# EAGLE design LSM9DS1-Breakout (EAGLE 9.3.2)
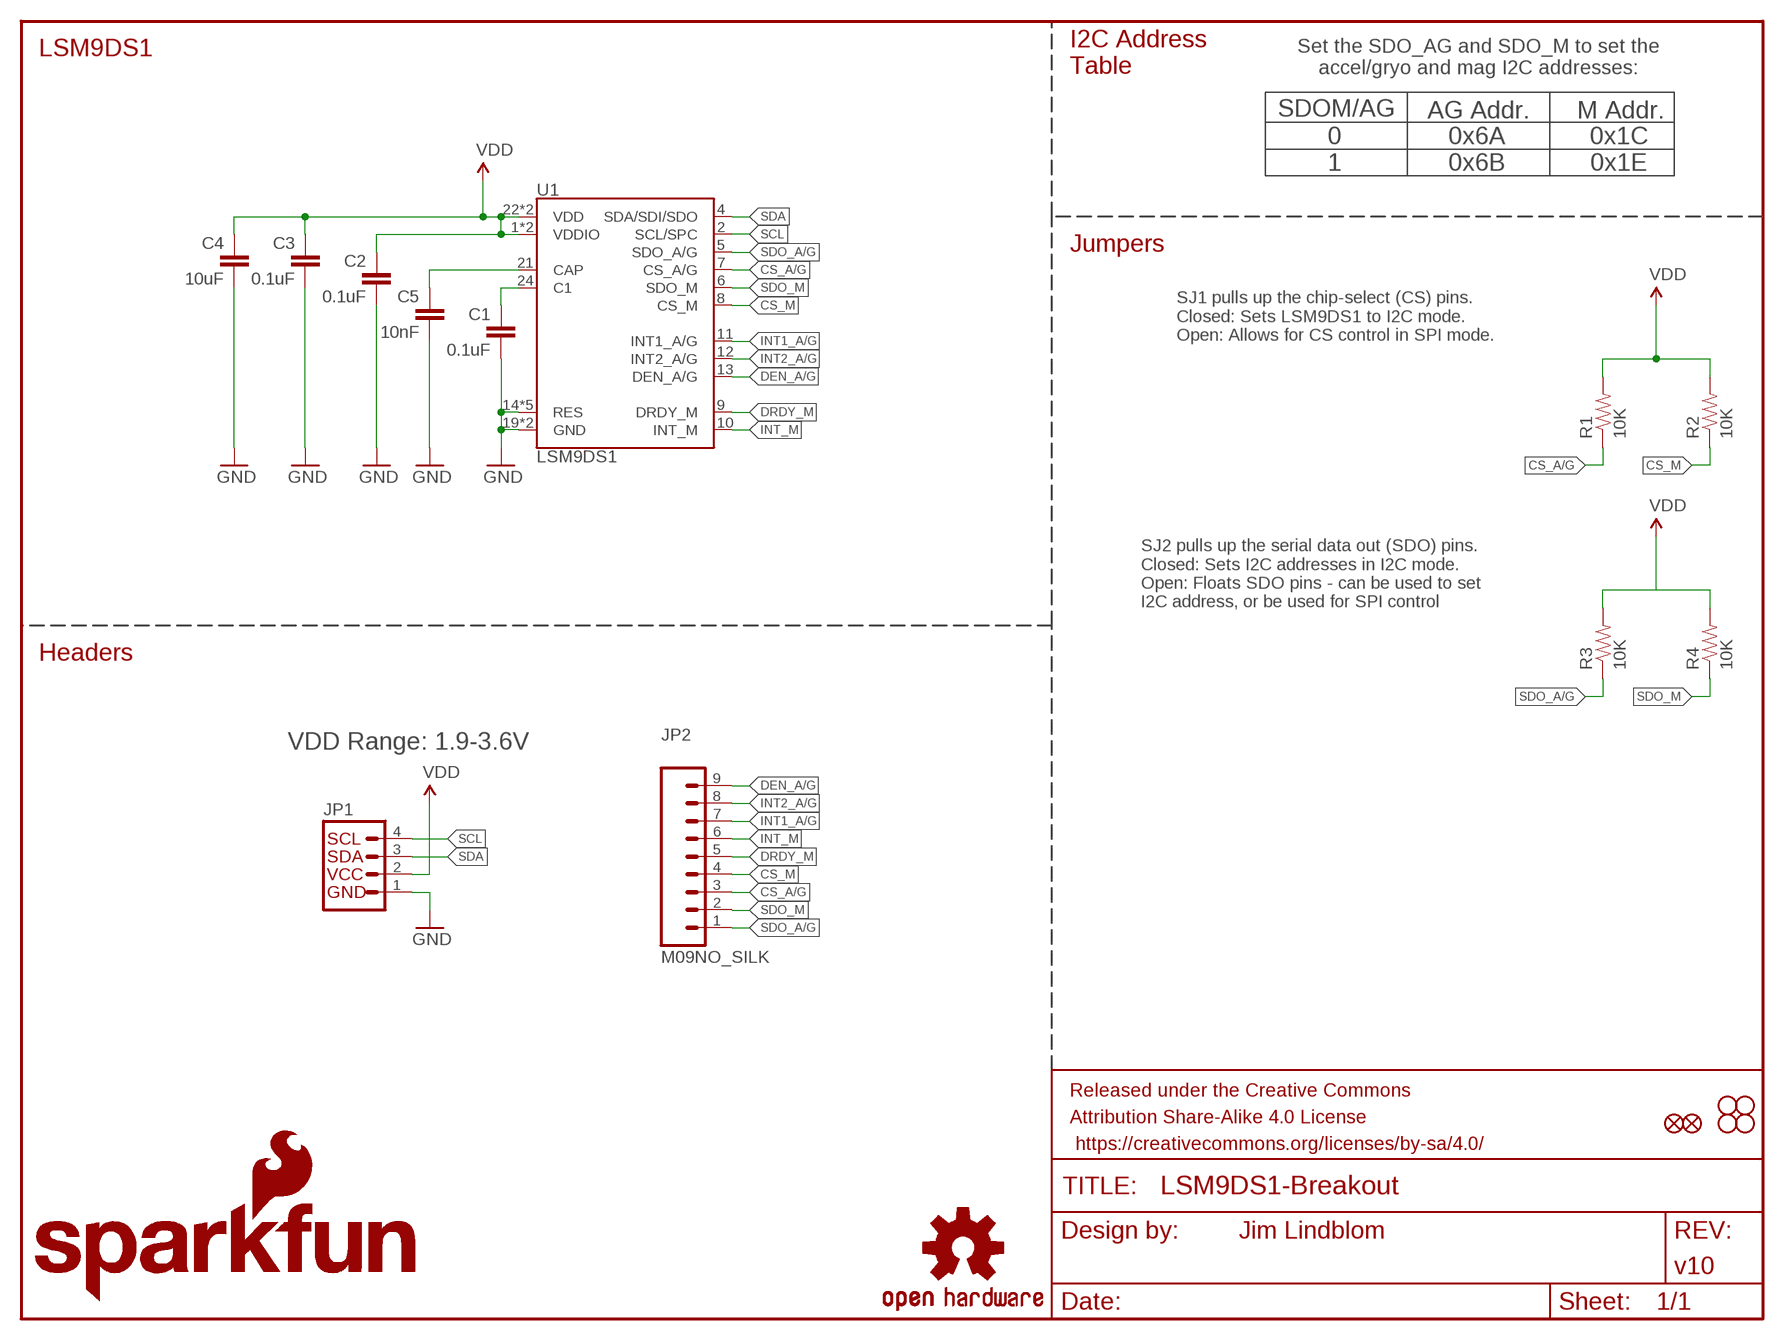
[diagram p0: schematic, sheet 1]

## Parts
C1  0.1uF  0.1UF-25V(+80/-20%)(0603)  [0603-CAP]
C2  0.1uF  0.1UF-25V(+80/-20%)(0603)  [0603-CAP]
C3  0.1uF  0.1UF-25V(+80/-20%)(0603)  [0603-CAP]
C4  10uF  10UF-6.3V-20%(0603)  [0603-CAP]
C5  10nF  10NF/10000PF-50V-10%(0603)  [0603-CAP]
FID1  FIDUCIAL1X2  [FIDUCIAL-1X2]
FID2  FIDUCIAL1X2  [FIDUCIAL-1X2]
FRAME1  FRAME-LETTER  [CREATIVE_COMMONS]
JP1  I2C_STANDARD_NO_SILK  [1X04_NO_SILK]
JP2  M09NO_SILK  [1X09_NO_SILK]
LOGO1  SFE_LOGO_NAME.1_INCH  [SFE_LOGO_NAME_.1]
LOGO2  SFE_LOGO_FLAME.2_INCH  [SFE_LOGO_FLAME_.2]
LOGO3  OSHW-LOGOS  [OSHW-LOGO-S]
R1  10K  10KOHM-1/10W-1%(0603)0603  [0603-RES]
R2  10K  10KOHM-1/10W-1%(0603)0603  [0603-RES]
R3  10K  10KOHM-1/10W-1%(0603)0603  [0603-RES]
R4  10K  10KOHM-1/10W-1%(0603)0603  [0603-RES]
STANDOFF1  STAND-OFF  [STAND-OFF]
STANDOFF2  STAND-OFF  [STAND-OFF]
STANDOFF3  STAND-OFF  [STAND-OFF]
STANDOFF4  STAND-OFF  [STAND-OFF]
U1  LSM9DS1  [LGA24-8X4]

## Nets
C1: C1.1 U1.24(C1)
CAP: C5.1 U1.21(CAP)
CS_A/G: JP2.3 R1.1 U1.7(CS_A/G)
CS_M: JP2.4 R2.1 U1.8(CS_M)
DEN_A/G: JP2.9 U1.13(DEN_A/G)
DRDY_M: JP2.5 U1.9(DRDY_M)
GND: C1.2 C2.2 C3.2 C4.2 C5.2 JP1.1 U1.14(RES) U1.15(RES) U1.16(RES) U1.17(RES) U1.18(RES) U1.19(GND) U1.20(GND)
INT1_A/G: JP2.7 U1.11(INT1_A/G)
INT2_A/G: JP2.8 U1.12(INT2_A/G)
INT_M: JP2.6 U1.10(INT_M)
SCL: JP1.4 U1.2(SCL/SPC)
SDA: JP1.3 U1.4(SDA/SDI/SDO)
SDO_A/G: JP2.1 R3.1 U1.5(SDO_A/G)
SDO_M: JP2.2 R4.1 U1.6(SDO_M)
VDD: C2.1 C3.1 C4.1 JP1.2 R1.2 R2.2 R3.2 R4.2 U1.1(VDDIO) U1.3(VDDIO) U1.22(VDD) U1.23(VDD)

## Notes on the sheet
- LSM9DS1
- Set the SDO_AG and SDO_M to set the
  accel/gryo and mag I2C addresses:
- I2C Address
  Table
- SDOM/AG | AG Addr. | M Addr.
- 0
  1
- 0x6A
  0x6B
- 0x1C
  0x1E
- Jumpers
- SJ1 pulls up the chip-select (CS) pins.
  Closed: Sets LSM9DS1 to I2C mode.
  Open: Allows for CS control in SPI mode.
- SJ2 pulls up the serial data out (SDO) pins.
  Closed: Sets I2C addresses in I2C mode.
  Open: Floats SDO pins - can be used to set
  I2C address, or be used for SPI control
- Headers
- VDD Range: 1.9-3.6V

## Library data of the parts
C1-C3 = SparkFun-Capacitors:0.1UF-25V(+80/-20%)(0603): CAP-00810 Ceramic Standard decoupling cap; PROD_ID: CAP-00810
C4 = SparkFun-Capacitors:10UF-6.3V-20%(0603): CAP-11015; PROD_ID: CAP-11015
C5 = SparkFun-Capacitors:10NF/10000PF-50V-10%(0603): CAP-00867; PROD_ID: CAP-00867
FID1 FID2 = SparkFun-Aesthetics:FIDUCIAL: Fiducial Alignment Points Various fiducial points for machine vision alignment.
FRAME1 = SparkFun-Aesthetics:FRAME-LETTER: Schematic Frame Standard 8.5x11 US Letter frame; DESIGNER: Jim Lindblom; VERSION: v10
JP1 = SparkFun-Connectors:I2C_STANDARD: SparkFun has standardized on a pinout for all I2C based sensor breakouts. This pinout allows I2C boards to be plugged directly into the headers on Arduino Uno compatible boards, and to be daisy chained easily.
JP2 = SparkFun-Connectors:M09: Header 9 Standard 9-pin 0.1" header. Use with straight break away headers (SKU : PRT-00116), right angle break away headers (PRT-00553), swiss pins (PRT-00743), machine pins (PRT-00117), and female headers (PRT-00115).
LOGO1 = SparkFun-Aesthetics:SFE_LOGO_NAME: SFE Logo, name only This is the SparkFun name logo. The logo on the schematic will always be the same size; the package variant is the height of the flame part of the logo (or the height the flame would be, if it were drawn). Default layer for the logo on the board is tSilk.
LOGO2 = SparkFun-Aesthetics:SFE_LOGO_FLAME: SFE Logo, flame only This is the SparkFun flame logo. The logo on the schematic will always be the same size; the package variant is the height of the flame. Default layer for the logo on the board is tSilk.
LOGO3 = SparkFun-Aesthetics:OSHW-LOGO: Open Source Hardware Logo This logo indicates the piece of hardware it is found on incorporates a OSHW license and/or adheres to the definition of open source hardware found here: http://freedomdefined.org/OSHW
R1-R4 = SparkFun-Resistors:10KOHM-1/10W-1%(0603): RES-00824; PROD_ID: RES-00824
STANDOFF1-STANDOFF4 = SparkFun-Electromechanical:STAND-OFF: #4 Stand Off This is the mechanical footprint for a #4 phillips button head screw. Use the keepout ring to avoid running the screw head into surrounding components. SKU : PRT-00447
U1 = LSM9DS1_temp:LSM9DS1: LSM9DS1 3D accelerometer, gyroscope & magnetometer The LSM9DS1 is a system-in-package featuring a 3D digital linear acceleration sensor, a 3D digital angular rate sensor, and a 3D digital magnetic sensor. The LSM9DS1 has a linear acceleration full scale of ±2g/±4g/±8/±16 g, a magnetic field full scale of ±4/±8/±12/±16 gauss and an angular rate of ±245/±500/±2000 dps. The LSM9DS1 includes an I2 C serial bus interface supporting standard and fast mode (100 kHz and 400 kHz) and an SPI serial standard interface. Magnetic, accelerometer and gyroscope sensing can be enabled or set in power-down mode separately for smart power management. The LSM9DS1 is available in a plastic land grid array package (LGA) and it is guaranteed to operate over an extended temperature range from -40 °C to +85 °C.; PROD_ID: IC-12536

## Board
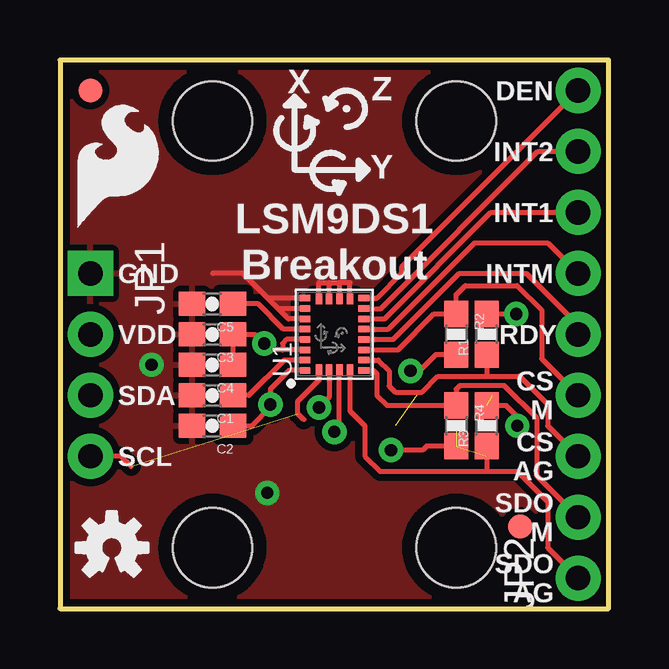
[diagram p1: board, top side]
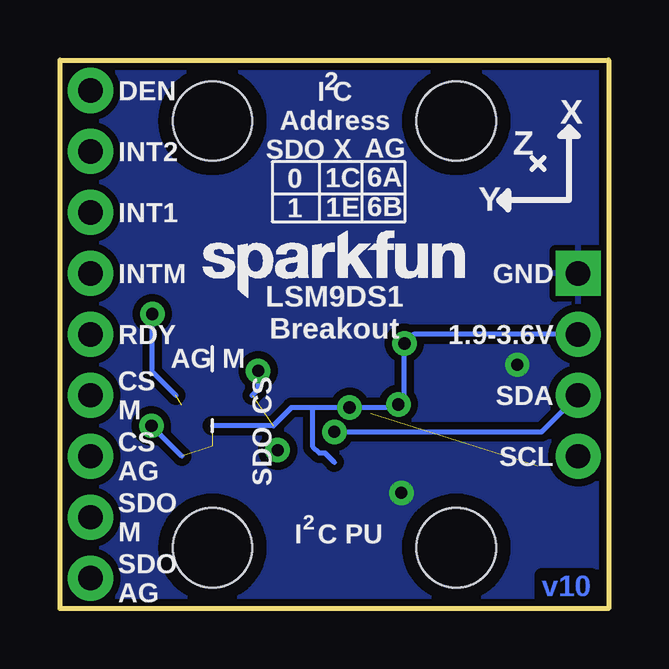
[diagram p2: board, bottom side, seen from below]

Size 22.86 x 22.86 mm. Coordinates in mm from the lower left corner, seen from the top.
Outline: 22.86,22.86 0,22.86 0,0 22.86,0 22.86,22.86
Copper layers (1*16): Top 0.035mm / dielectric 1.5mm / Bottom 0.035mm
Design rules "SparkFun-2-layer *": minimum track width 7mil, minimum drill 15mil, track to track 6mil, track to pad 6mil, pad to pad 6mil, via to via 6mil, smd to smd 6mil, copper to edge 8mil, drill to drill 8mil, minimum pad ring 12mil, minimum via ring 10mil, stop-mask expansion 4mil, vias tented up to drill 20mil, thermal gap 10mil

### Footprints (pad centres in the part's own frame; a part is rotated, then mirrored left to right if it is on the bottom)
0603-CAP = smd 1.1 x 1: 1 -0.85,0; 2 0.85,0
FIDUCIAL-1X2 = smd 1 x 1: 1 0,0
1X04_NO_SILK = drill 1.016 pad 1.88 square: 1 0,0 | drill 1.016 pad 1.88: 2 2.54,0; 3 5.08,0; 4 7.62,0
1X09_NO_SILK = drill 1.016 pad 1.88: 1 0,0; 2 2.54,0; 3 5.08,0; 4 7.62,0; 5 10.16,0; 6 12.7,0; 7 15.24,0; 8 17.78,0; 9 20.32,0
0603-RES = smd 1.1 x 1: 1 -0.85,0; 2 0.85,0
STAND-OFF = hole 3.302: 0,0
LGA24-8X4 = smd 0.27 x 0.45: 1 -1.505,1.225; 6 -1.505,-1.225; 7 -1.075,-1.225; 8 -0.645,-1.225; 9 -0.215,-1.225; 10 0.215,-1.225; 11 0.645,-1.225; 12 1.075,-1.225; 13 1.505,-1.225; 18 1.505,1.225; 19 1.075,1.225; 20 0.645,1.225; 21 0.215,1.225; 22 -0.215,1.225; 23 -0.645,1.225; 24 -1.075,1.225 | smd 0.45 x 0.27: 2 -1.475,0.645; 3 -1.475,0.215; 4 -1.475,-0.215; 5 -1.475,-0.645; 14 1.475,-0.645; 15 1.475,-0.215; 16 1.475,0.215; 17 1.475,0.645

### Placement (x,y rotation side)
C1  6.35,8.89 180 top
C2  6.35,7.62 180 top
C3  6.35,11.43 180 top
C4  6.35,10.16 180 top
C5  6.35,12.7 180 top
FID1  19.18,3.43 270 top
FID2  1.27,21.59 270 top
FRAME1  -15.24,-22.86 0 top  (outside the outline)
JP1  1.27,13.97 270 top
JP2  21.59,1.27 90 top
LOGO1  17.4,12.45 0 bottom
LOGO2  0.38,15.62 0 top
LOGO3  2.16,2.54 0 top
R1  17.78,11.43 90 top
R2  16.51,11.43 270 top
R3  17.78,7.62 90 top
R4  16.51,7.62 270 top
STANDOFF1  6.35,20.32 270 top
STANDOFF2  16.51,2.54 270 top
STANDOFF3  16.51,20.32 270 top
STANDOFF4  6.35,2.54 270 top
U1  11.43,11.43 90 top

### Tracks (layer width: path | path; a pad name or v marks a point on that pad's centre or on a via)
C1
  Top 0.203: U1.24 9.34,10.36 7.87,8.89 C1.1
CAP
  Top 0.203: U1.21 9.31,11.64 8.26,12.7 C5.1
CS_A/G
  Top 0.203: U1.7 13.27,10.36 13.72,9.91 13.72,9.27 13.97,9.02 15.09,9.02 15.75,9.68 17.78,9.68 | 17.78,9.68 19.15,9.68 20.32,8.51 20.32,7.62 JP2.3 | R1.1 17.78,9.68
CS_M
  Top 0.203: U1.8 14.09,10.79 15.58,12.28 R2.1 16.51,13.08 16.89,13.46 19.05,13.46 20.07,12.45 20.07,10.41 JP2.4
DEN_A/G
  Top 0.203: U1.13 13.21,12.94 14.25,13.97 14.25,14.25 JP2.9
DRDY_M
  Top 0.203: U1.9 13.88,11.21 16.64,13.97 19.43,13.97 21.59,11.81 JP2.5
GND  (via drill 0.51)
  Top 0.203: U1.14 12.07,13.59 11.64,13.59 | 11.64,13.59 U1.15 | U1.16 11.21,13.59 | 11.21,13.59 11.64,13.59 | U1.17 10.79,13.59 11.21,13.59 | 9.09,12.51 9.52,12.07 U1.20 | 9.09,12.51 8.65,12.94 | U1.18 8.65,12.94 | 8.65,12.94 7.62,13.97 6.35,13.97 | U1.19 9.09,12.51
  other vias: 8.64,4.83 3.81,10.16
  pour Top (isolate 0.305): 0,22.86 22.86,22.86 22.86,0 0,0
  pour Bottom (isolate 0.305): 0,22.86 22.86,22.86 22.86,0 0,0
INT1_A/G
  Top 0.203: U1.11 13.52,12.07 17.96,16.51 JP2.7
INT2_A/G
  Top 0.203: U1.12 13.37,12.51 19.91,19.05 JP2.8
INT_M
  Top 0.203: U1.10 13.68,11.64 17.27,15.24 20.32,15.24 JP2.6
SCL  (1 unrouted)
  Top 0.203: U1.2 10.79,9.52 9.91,8.64 9.91,8.13 10.16,7.87 | 2.96,5.93 2.54,6.35 JP1.4
SDA  (via drill 0.51)
  Top 0.203: v11.43,7.37 11.64,7.58 U1.4
  Bottom 0.203: v11.43,7.37 2.79,7.37 JP1.3
SDO_A/G
  Top 0.203: U1.5 12.07,8.24 12.7,7.62 12.7,6.35 13.34,5.71 17.78,5.71 | 17.78,5.71 19.05,5.71 20.32,4.45 20.32,2.54 JP2.1 | R3.1 17.78,5.71
SDO_M
  Top 0.203: U1.6 13.06,9.93 13.21,9.78 13.21,8.89 13.63,8.47 R4.1 16.51,9.14 16.66,9.3 18.52,9.3 19.86,7.95 19.86,5.54 JP2.2
VDD  (via drill 0.51)  (4 unrouted)
  Top 0.203: C4.1 C3.1 8.13,11.43 v8.51,11.05 8.77,10.79 9.27,10.79 | U1.23 9.27,10.79 | U1.1 9.54,9.93 8.76,9.14 v8.76,8.51 8.76,8.45 8.76,8.38 8,7.62 C2.1 | U1.3 11.21,8.8 v10.79,8.38 | U1.22 9.44,11.21 9.27,11.05 9.27,10.79 | 18.2,12.28 R1.2 v19.01,12.28 | R2.2 15.66,10.58 14.99,9.91 v14.61,9.91 | R3.2 18.58,8.47 19.05,8 v19.05,7.62 | R4.2 15.28,6.77 15.11,6.6 v13.79,6.6
  Bottom 0.203: 12.32,8.38 13.21,8.38 13.97,7.62 16.51,7.62 | 12.32,8.38 v10.79,8.38 8.89,8.38 v8.76,8.51 8.51,8.76 v8.51,11.05 8.13,11.43 JP1.2 | 11.43,6.1 11.81,6.48 12.06,6.48 12.32,6.73 12.32,8.38 | 18.03,8.89 19.01,9.87 v19.01,12.28 | 14.86,8.89 14.61,9.14 v14.61,9.91 | 17.78,6.35 v19.05,7.62 | 14.05,6.35 v13.79,6.6

### Text on the board
tPlace: DEN | X | Z | INT2 | Y | LSM9DS1 / Breakout | INT1 | GND | INTM | VDD | RDY | SDA | CS / M | SCL | CS / AG | SDO / M | SDO / AG
bPlace: 2 | DEN | I C / Address | X | Z | INT2 | Y | AG / 6A / 6B | X / 1C / 1E | SDO / 0 / 1 | INT1 | GND | INTM | LSM9DS1 / Breakout | 1.9-3.6V | RDY | M | AG | SDA | CS | CS / M | SCL | SDO | CS / AG | SDO / M | C PU | 2 | I | SDO / AG
Measures: Units in inches